# Altium schematic sheet PWR_TPS65270.SchDoc
size A3
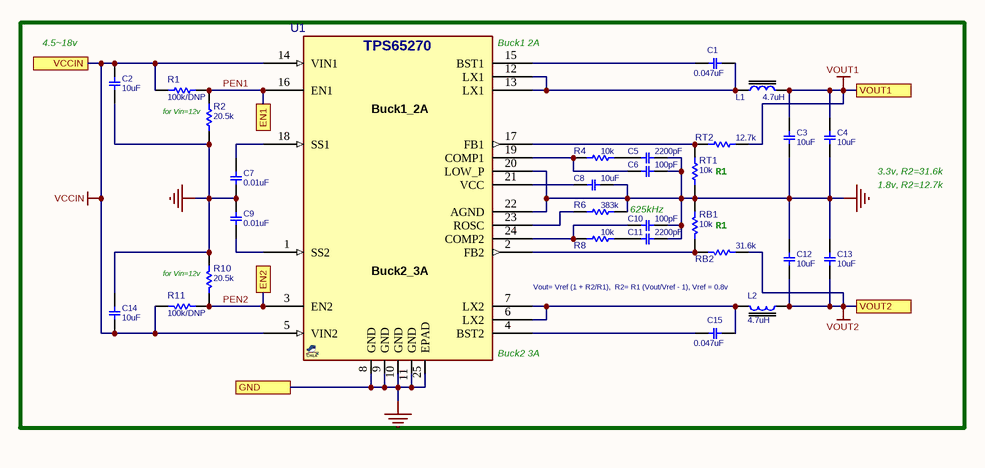
[diagram p0: PWR_TPS65270.SchDoc]

## Parts
C1  0.047uF  [C0402]
C2  10uF  [C0603]
C3  10uF  [C0603]
C4  10uF  [C0603]
C5  2200pF  [C0402]
C6  100pF  [C0402]
C7  0.01uF  [C0402]
C8  10uF  [C0603]
C9  0.01uF  [C0402]
C10  100pF  [C0402]
C11  2200pF  [C0402]
C12  10uF  [C0603]
C13  10uF  [C0603]
C14  10uF  [C0603]
C15  0.047uF  [C0402]
L1  4.7uH  [L_6]
L2  4.7uH  [L_6]
R1  100k/DNP  [R0402]
R2  20.5k  [R0402]
R4  10k  [R0402]
R6  383k  [R0402]
R8  10k  [R0402]
R10  20.5k  [R0402]
R11  100k/DNP  [R0402]
RB1  10k  [R0402]
RB2  31.6k  [R0402]
RT1  10k  [R0402]
RT2  12.7k  [R0402]
U1  TPS65270  [QFN50_24T]  (value not drawn)

## Ports
EN1, EN2, GND, VCCIN, VOUT1, VOUT2

## Nets
GND: C2.1 C3.1 C4.1 C5.2 C6.2 C7.2 C8.1 C9.1 C10.2 C11.2 C12.1 C13.1 C14.1 R2.1 R6.2 R10.1 RB1.2 RT1.2 U1.8(GND) U1.9(GND) U1.10(GND) U1.11(GND) U1.20(LOW_P) U1.22(AGND) U1.25(EPAD) ; port GND
VCCIN: C2.2 C14.2 R1.1 R11.1 U1.5(VIN2) U1.14(VIN1) ; port VCCIN
VOUT1: C3.2 C4.2 L1.2 RT2.1 ; port VOUT1
VOUT2: C12.2 C13.2 L2.2 RB2.1 ; port VOUT2
PEN1: R1.2 R2.2 U1.16(EN1) ; port EN1
PEN2: R10.2 R11.2 U1.3(EN2) ; port EN2
NetC1_1: C1.1 U1.15(BST1)
NetC1_2: C1.2 L1.1 U1.12(LX1) U1.13(LX1)
NetC5_1: C5.1 R4.2
NetC6_1: C6.1 R4.1 U1.19(COMP1)
NetC7_1: C7.1 U1.18(SS1)
NetC8_2: C8.2 U1.21(VCC)
NetC9_2: C9.2 U1.1(SS2)
NetC10_1: C10.1 R8.1 U1.24(COMP2)
NetC11_1: C11.1 R8.2
NetC15_1: C15.1 U1.4(BST2)
NetC15_2: C15.2 L2.1 U1.6(LX2) U1.7(LX2)
NetR6_1: R6.1 U1.23(ROSC)
NetRB1_1: RB1.1 RB2.2 U1.2(FB2)
NetRT1_1: RT1.1 RT2.2 U1.17(FB1)

## Notes on the sheet
- (near C2) 4.5~18v
- (near U1) Buck1 2A
- (near R2) for Vin=12v
- R1
- (near C4) 3.3v, R2=31.6k
- 1.8v, R2=12.7k
- 625kHz
- (near R10) for Vin=12v
- (near L2) Vout= Vref (1 + R2/R1),  R2= R1 (Vout/Vref - 1), Vref = 0.8v
- (near U1) Buck2 3A
- (in symbol VREG_TPS65270_QFN24) Buck1_2A; Buck2_3A

## Library data of the parts
C1 C15 = CAP_SMD_MLCC_100n50V: CAP, MLCC; PARAM: 50V; MANF: Murata; DESC: CAP, MLCC, 100nF, 50V, X7R, 10%, 0402C; PARAM2: X7R, 10%; ASSEMBLY: ASSEMBLY; PRICE: 100= 1.3$; VALUE: 0.047uF; MANF_P#: -
C2-C4 C8 C12-C14 = CAP_SMD_MLCC: CAP, MLCC; PARAM: X5R, 10%; MANF: Samsung; PARAM2: 25v; PRICE: 10,000: $0.034; MANF_P#: -; ASSEMBLY: ASSEMBLY; VALUE: 10uF
C5-C7 C9-C11 = CAP_SMD_MLCC_100n50V: CAP, MLCC, 0402C; PARAM: 50V; MANF: Murata; DESC: -; PARAM2: -; ASSEMBLY: ASSEMBLY; PRICE: 100= 1.3$
  C5 C11: VALUE: 2200pF
  C6 C10: VALUE: 100pF
  C7 C9: VALUE: 0.01uF
L1 L2 = IND_SMD_2.2uH_4A: INDUCTOR; PARAM: 4.2 It, 5.8A Isat; MANF: Vishay; PARAM2: 27mOhm; MANF_P#: VLS6045EX-4R7M; PRICE: 0.4$; ASSEMBLY: ASSEMBLY; VALUE: 4.7uH
R1 R2 R10 R11 = RES_SMD: RESISTOR, SMD, 20K, 0402; MANF: KOA SPEER; PARAM: 0.063W; DIST#: MOUSER; PARAM2: 1%; MANF_P#: RK73Z1ETTP; ASSEMBLY: ASSEMBLY; PRICE: 100= 0.5$; DESC: RESISTOR, SMD, 20K, 0402
  R1 R11: VALUE: 100k/DNP
  R2 R10: VALUE: 20.5k
R4 R6 R8 RB1 RB2 RT1 RT2 = RES_SMD: RESISTOR, SMD, 20K, 0402; MANF: Yageo; PARAM: 0.063W; DIST#: MOUSER; PARAM2: 1%; MANF_P#: RK73H1ETTP2002F; ASSEMBLY: ASSEMBLY; PRICE: 100= 0.5$; DESC: RESISTOR, SMD, 20K, 0402
  R4 R8 RB1 RT1: VALUE: 10k
  R6: VALUE: 383k
  RB2: VALUE: 31.6k
  RT2: VALUE: 12.7k
U1 = VREG_TPS65270_QFN24: REG, Switching, Buck, Dual 2A/3A, ADJ, 1.4MHz, 4.5~18VIN, QFN-24; MANF: Analog Devices; MANF_P#: TPS65270RGE; PARAM: 2A/3A, ADJ, -40~125°C; ASSEMBLY: ASSEMBLY; PARAM2: 1.4MHz, 4.5~18VIN; PRICE: 0.5$; VALUE: TPS65270